# Altium schematic sheet Peripherals.SchDoc: Peripherals
size A4; Project: STM32H7-DK; Date: Not used; ApprovedBy: Not used; CheckedBy: Not used; Author: Not used; CompanyName: STMicroelectronics; DrawnBy: Not used; Engineer: Not used; Organization: Not used; Address1: Not used; Address2: Not used; Address3: Not used; Address4: Not used; DocumentNumber: Not used; Revision: Not used; SheetNumber: 10; SheetTotal: 16; CurrentTime: Not used; CurrentDate: Not used; Time: Not used; DocumentFullPathAndName: Not used; DocumentName: Not used; ModifiedDate: Not used; ImagePath: Not used; ProjectName: Not used; Application_BuildNumber: Not used
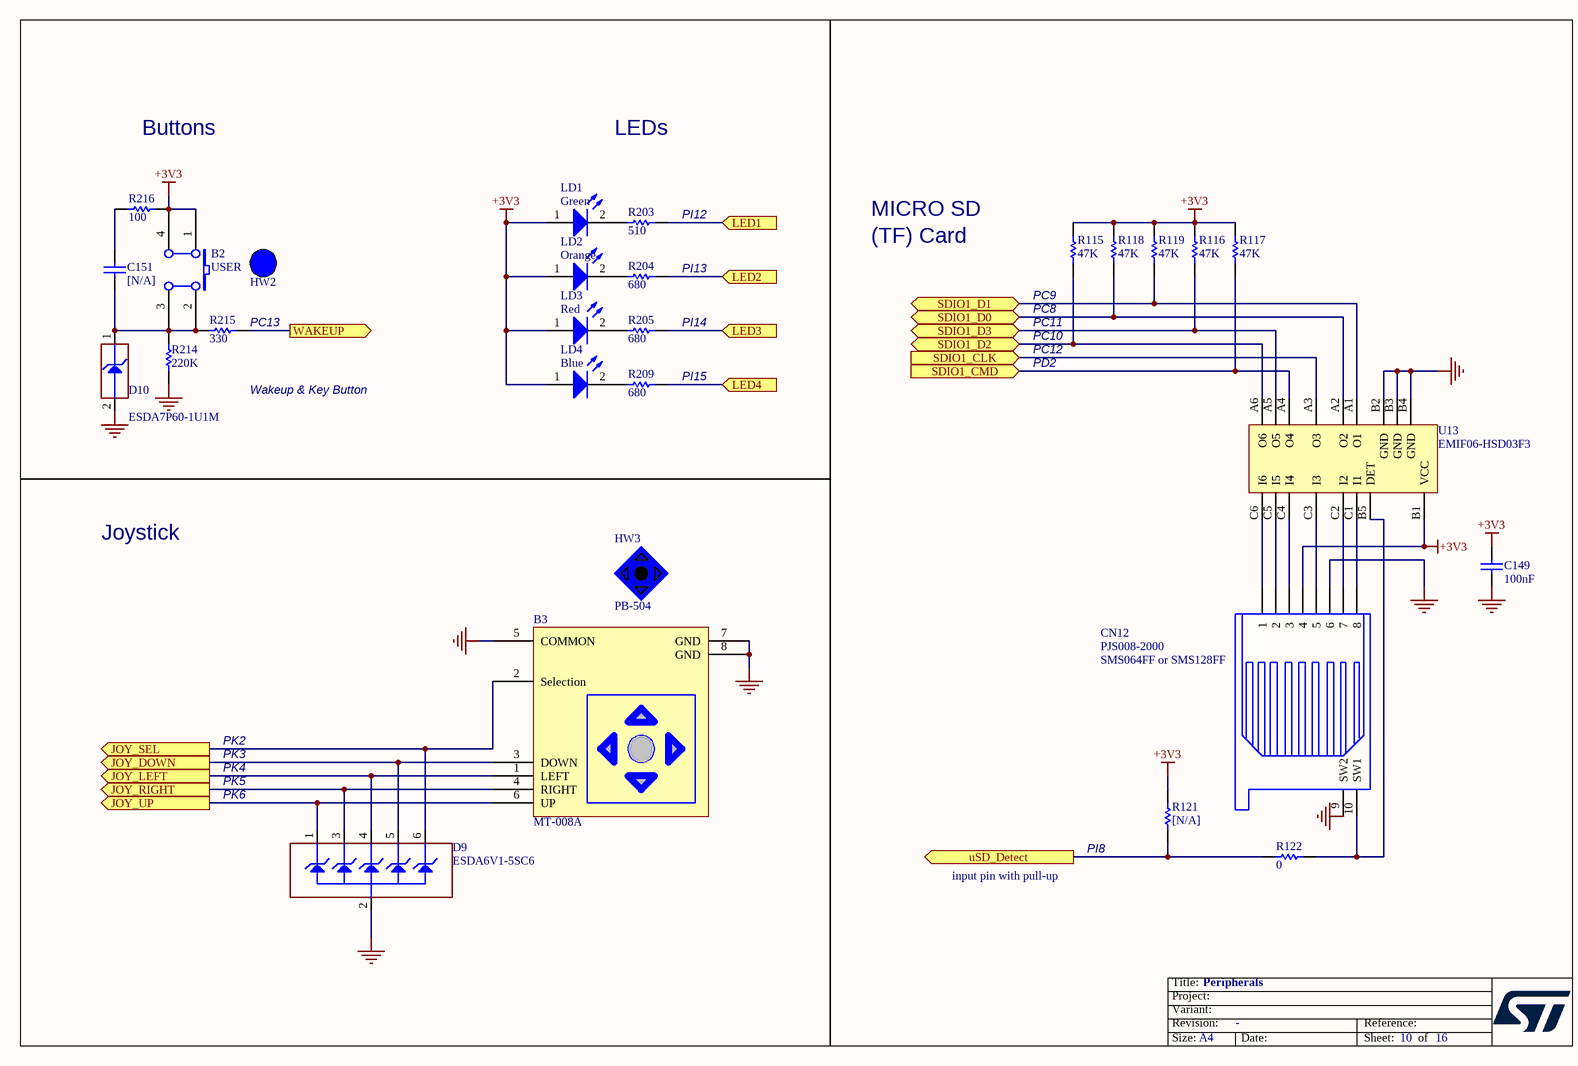
[diagram p0: Peripherals.SchDoc]

## Parts
B2  USER  [PB10]
B3  MT-008A  [MT-008A]
C149  100nF  [0603C]
C151  [N/A]  [0603C]
CN12  PJS008-2000  [MSD_PJS008_]
D9  ESDA6V1-5SC6  [SOT23-6L]
D10  ESDA7P60-1U1M  [DO_2SM_1R6X1_21]
HW2  BUTTON_HAT_BLUE  (value not drawn)  (mechanical)
HW3  value PB-504  (hidden comment: JOYSTICK_BLUE_HAT)  (mechanical)
LD1  Green  [0603D]
LD2  Orange  [0603D]
LD3  Red  [0603D]
LD4  Blue  [0603D]
R115  47K  [0603R]
R116  47K  [0603R]
R117  47K  [0603R]
R118  47K  [0603R]
R119  47K  [0603R]
R121  [N/A]  [0603R]
R122  0  [0603R]
R203  510  [0603R]
R204  680  [0603R]
R205  680  [0603R]
R209  680  [0603R]
R214  220K  [0603R]
R215  330  [0603R]
R216  100  [0603R]
U13  EMIF06-HSD03F3  [FBGA17_0R4_1R1X2R4]

## Ports
JOY_DOWN (out), JOY_LEFT (out), JOY_RIGHT (out), JOY_SEL (out), JOY_UP (out), LED1 (in), LED2 (in), LED3 (in), LED4 (in), SDIO1_CLK (in), SDIO1_CMD (in), SDIO1_D0 (bidir), SDIO1_D1 (bidir), SDIO1_D2 (bidir), SDIO1_D3 (bidir), uSD_Detect (out), WAKEUP (out)

## Nets
+3V3: B2.1(A0) B2.4(A1) C149.1 CN12.4 LD1.1(A) LD2.1(A) LD3.1(A) LD4.1(A) R115.1 R116.1 R117.1 R118.1 R119.1 R121.2 R216.1 U13.B1(VCC)
GND: B3.5(COMMON) B3.7(GND) B3.8(GND) C149.2 CN12.6 CN12.9(SW2) D9.2(GND) D10.2(GND) R214.2 U13.B2(GND) U13.B3(GND) U13.B4(GND)
JOY_DOWN: B3.3(DOWN) D9.5(IO4) ; port JOY_DOWN
JOY_LEFT: B3.1(LEFT) D9.4(IO3) ; port JOY_LEFT
JOY_RIGHT: B3.4(RIGHT) D9.3(IO2) ; port JOY_RIGHT
JOY_SEL: B3.2(Selection) D9.6(IO5) ; port JOY_SEL
JOY_UP: B3.6(UP) D9.1(IO1) ; port JOY_UP
LED1: R203.1 ; port LED1
LED2: R204.1 ; port LED2
LED3: R205.1 ; port LED3
LED4: R209.1 ; port LED4
SDIO1_CLK: U13.A3(O3) ; port SDIO1_CLK
SDIO1_CMD: R117.2 U13.A4(O4) ; port SDIO1_CMD
SDIO1_D0: R118.2 U13.A2(O2) ; port SDIO1_D0
SDIO1_D1: R119.2 U13.A1(O1) ; port SDIO1_D1
SDIO1_D2: R115.2 U13.A6(O6) ; port SDIO1_D2
SDIO1_D3: R116.2 U13.A5(O5) ; port SDIO1_D3
uSD_Detect: R121.1 R122.1 ; port uSD_Detect
WAKEUP: R215.2 ; port WAKEUP
NetB2_2: B2.2(B0) B2.3(B1) C151.1 D10.1(IO1) R214.1 R215.1
NetC151_2: C151.2 R216.2
NetCN12_1: CN12.1 U13.C6(I6)
NetCN12_2: CN12.2 U13.C5(I5)
NetCN12_3: CN12.3 U13.C4(I4)
NetCN12_5: CN12.5 U13.C3(I3)
NetCN12_7: CN12.7 U13.C2(I2)
NetCN12_8: CN12.8 U13.C1(I1)
NetCN12_10: CN12.10(SW1) R122.2 U13.B5(DET)
NetLD1_2: LD1.2(K) R203.2
NetLD2_2: LD2.2(K) R204.2
NetLD3_2: LD3.2(K) R205.2
NetLD4_2: LD4.2(K) R209.2

## Notes on the sheet
- Buttons
- LEDs
- (near R203) PI12
- MICRO SD
- (TF) Card
- (near R215) PC13
- (near R204) PI13
- (near R205) PI14
- (near R115) PC8
- (near R115) PC9
- PC11
- Wakeup & Key Button
- (near R209) PI15
- PC10
- PC12
- PD2
- Joystick
- (near CN12) SMS064FF or SMS128FF
- PK2
- PK3
- PK4
- PK5
- PK6
- PI8
- input pin with pull-up
- Title:
- Project:
- Size:
- Revision:
- Variant:
- A4
- -
- Date:
- Reference:
- Sheet:
- of

## Library data of the parts
B2 = SW PUSHBUTTON: SE PUSHBUTTON
C149 = CAP: Capacitor; Published: 8-Jun-2000; Revision: July-2002: Re-released for DXP Platform.; Publisher: Altium Limited; Value: 100nF
C151 = cap: Capacitor; Value: 100nF; Ordered by: Subcon; ECCN_US/EU: NA; Fitted: NO; Published: 8-Jun-2000; Revision: July-2002: Re-released for DXP Platform.; Publisher: Altium Limited
CN12 = SMS016AFA5E
D9 = ESDA6V1-5SC6: 5-line ESD protection; Manuf_1: STM; Fitted: YES; ECCN_US/EU: EAR99/NEC; Manuf_Part_1: ESDA6V1-5SC6; Distrib: ST; Order: ESDA6V1-5SC6; Ordered by: STM
D10 = ESDALC6V1-1U2: Dual Transil array for ESD protection; Manuf_1: STM; Ref St: .; ECCN_US/EU: EAR99/NEC; Fitted: YES; Provided: ST; Manuf_Part_1: ESDA7P60-1U1M; Distrib: ST; Ordered by: STM; Order: ESDA7P60-1U1M
HW3 = MCD-01337: Joystick, Blue hat; Part_Type: Misc; Part_Preference: Alternate; Manufacturer: JIUBABA; Component_Country_Of_Origin: Unknown; Alternate_EMS: A; ShowFields: YES; ID: 3437; Internal_Part_Number: MCD-01337; Status: Released; Manufacturer_Part_Number: PB-504; Package: 8.9x8.9mm; ComponentLink1URL: http://tunmcdsvn.tun.st.com/Component_Documentation_Library/Trunk/Misc/JIUBABA_PB-504; Order_Code_Digikey: N/A; Order_Code_Farnell: N/A; Order_Code_RS: N/A; Manufacturer_HQ_COO: Unknown
LD1-LD4 = LED2: Typical RED, GREEN, YELLOW, AMBER GaAs LED; Published: 8-Jun-2000; Revision: July-2002: Re-released for DXP Platform.; Publisher: Altium Limited
R115-R119 R214 = res1: Resistor; Value: 1K; Published: 8-Jun-2000; Revision: July-2002: Re-released for DXP Platform.; Publisher: Altium Limited
R121 = res1: Resistor; Value: 10K; Ordered by: Subcon; ECCN_US/EU: NA; Fitted: NO; Published: 8-Jun-2000; Revision: July-2002: Re-released for DXP Platform.; Publisher: Altium Limited
R122 R203-R205 R209 R215 R216 = Res1: Resistor; Value: 1K; Published: 8-Jun-2000; Revision: July-2002: Re-released for DXP Platform.; Publisher: Altium Limited
U13 = EMIF06-HSD03F3: EMI filter with integrated ESD protection for micro-SD Card™; Ordered by: STM; Fitted: YES; ECCN_US/EU: EAR99/NEC; Manuf_1: STM; Manuf_Part_1: EMIF06-HSD03F3